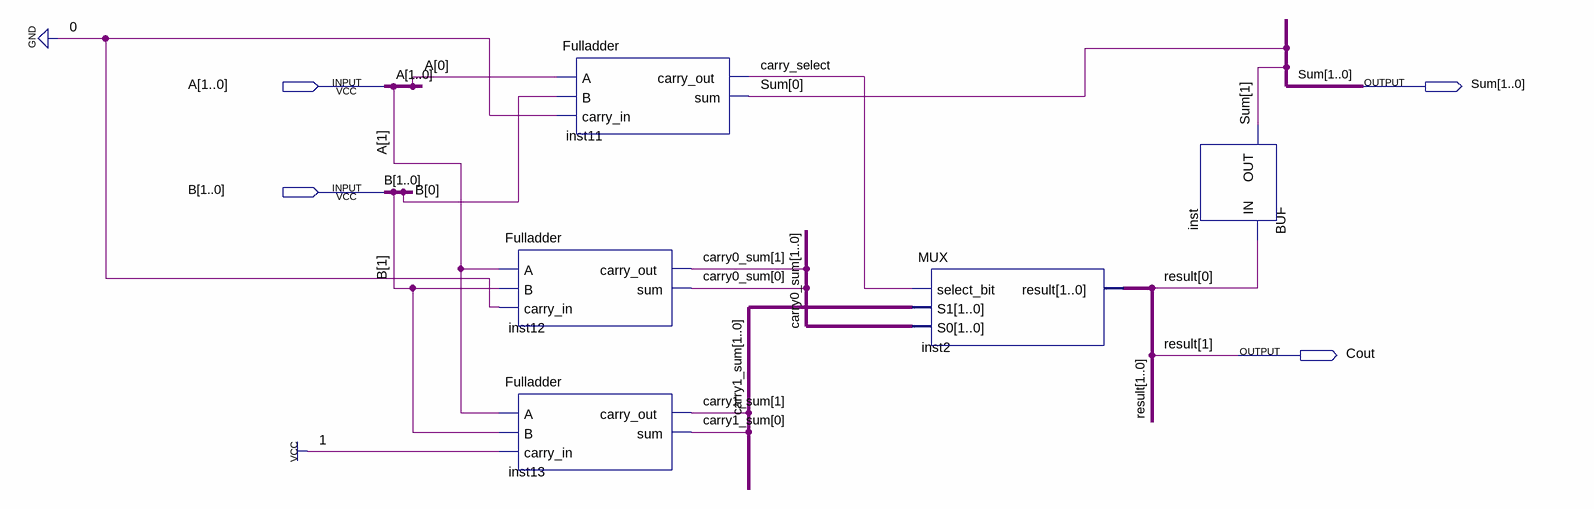
[diagram p0: schematic sheet]
// Quartus schematic CSA.bdf as structural Verilog: 5 symbols, 4 pins
module CSA (
  input  [1:0] A,
  input  [1:0] B,
  output [1:0] Sum,
  output Cout
);

  wire carry_select;
  wire [0:0] result;
  wire [1:0] carry0_sum, carry1_sum;

  Fulladder inst12 (.A(A[1]), .B(B[1]), .carry_in(1'b0), .carry_out(carry0_sum[1]), .sum(carry0_sum[0]));
  Fulladder inst13 (.A(A[1]), .B(B[1]), .carry_in(1'b1), .carry_out(carry1_sum[1]), .sum(carry1_sum[0]));
  Fulladder inst11 (.A(A[0]), .B(B[0]), .carry_in(1'b0), .carry_out(carry_select), .sum(Sum[0]));
  MUX inst2 (.select_bit(carry_select), .S1(carry1_sum), .S0(carry0_sum), .result({Cout, result[0]}));
  BUF inst (.IN(result[0]), .OUT(Sum[1]));

  // Other names for the same wires on the sheet: result[1] = Cout
endmodule
